# EAGLE design Schematic (EAGLE 7.6.0)
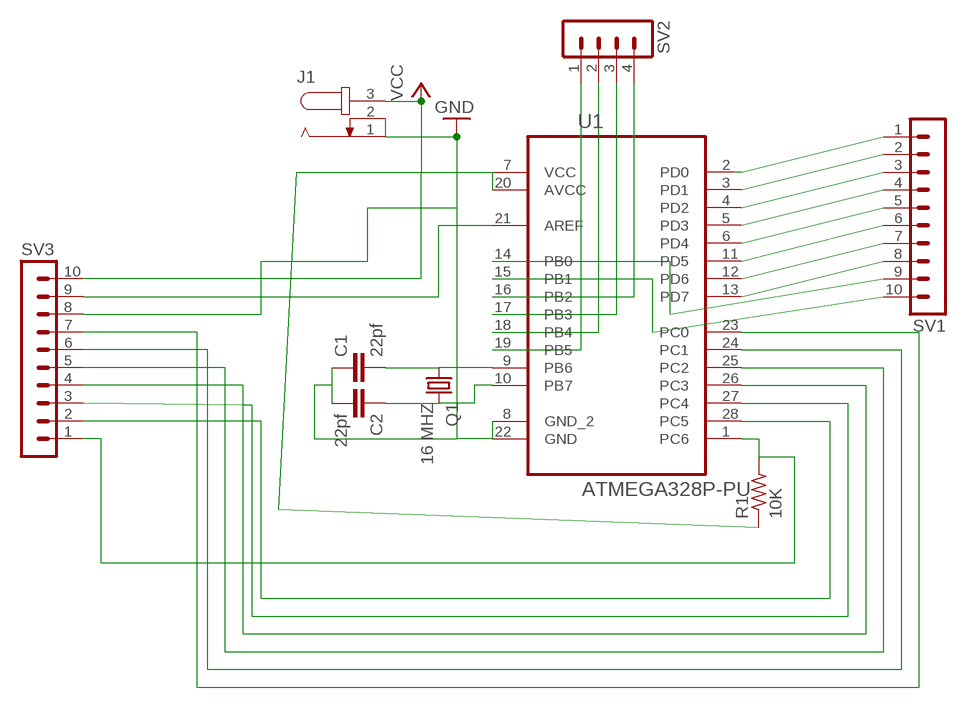
[diagram p0: schematic, sheet 1]

## Parts
C1  22pf  C-EU025-024X044  [C025-024X044]
C2  22pf  C-EU025-024X044  [C025-024X044]
J1  JACK-PLUG0  [SPC4077]
Q1  16 MHZ  CRYSTALHC49S  [HC49/S]
R1  10K  R-US_0207/10  [0207/10]
SV1  MA10-1  [MA10-1]
SV2  MA04-1  [MA04-1]
SV3  MA10-1  [MA10-1]
U1  ATMEGA328P-PU  [DIP254P762X457-28]

## Nets
GND: C1.1 C2.2 J1.1 J1.2 SV3.8 U1.8(GND_2) U1.22(GND)
N$3: C1.2 Q1.1 U1.9(PB6)
N$4: C2.1 Q1.2 U1.10(PB7)
N$5: SV1.1 U1.2(PD0)
N$6: SV1.2 U1.3(PD1)
N$7: R1.2 SV3.1 U1.1(PC6)
N$8: SV1.3 U1.4(PD2)
N$9: SV1.4 U1.5(PD3)
N$10: SV1.5 U1.6(PD4)
N$11: SV1.6 U1.11(PD5)
N$12: SV1.7 U1.12(PD6)
N$13: SV1.8 U1.13(PD7)
N$14: SV1.9 U1.14(PB0)
N$15: SV1.10 U1.15(PB1)
N$16: SV2.4 U1.16(PB2)
N$17: SV2.3 U1.17(PB3)
N$18: SV2.2 U1.18(PB4)
N$21: SV3.2 U1.28(PC5)
N$22: SV3.3 U1.27(PC4)
N$23: SV3.4 U1.26(PC3)
N$24: SV3.5 U1.25(PC2)
N$25: SV3.6 U1.24(PC1)
N$26: SV3.7 U1.23(PC0)
N$27: SV3.9 U1.21(AREF)
N$32: SV2.1 U1.19(PB5)
VCC: J1.3 R1.1 SV3.10 U1.7(VCC) U1.20(AVCC)

## Library data of the parts
C1 C2 = resistor:C-EU: CAPACITOR, European symbol
J1 = con-jack:JACK-PLUG: DC POWER JACK Power Jack, DC, Right Angle, Through Hole, Rated 5A at 16VDC, PC Terminals Distributor: Farnell (www.Farnell.de) Drawing: 84N1161.pdf / 84N1162.pdf Manufacturer: SPC Technology (www.spctechnology.com) Type: SPC4077 / SPC 4078; OC_FARNELL: unknown; OC_NEWARK: unknown
Q1 = crystal:CRYSTAL: CRYSTAL; OC_FARNELL: 1667008; OC_NEWARK: unknown
R1 = resistor:R-US_: RESISTOR, American symbol
SV1 SV3 = con-lstb:MA10-1: PIN HEADER; OC_FARNELL: unknown; OC_NEWARK: unknown
SV2 = con-lstb:MA04-1: PIN HEADER; OC_FARNELL: unknown; OC_NEWARK: unknown
U1 = Atmel_By_element14_Batch_1-00:ATMEGA328P-PU: 8-bit Microcontroller with In-System Programmable Flash; MPN: ATMEGA328P-PU; OC_FARNELL: 1715487; OC_NEWARK: 15R0268; PACKAGE: PDIP-28; SUPPLIER: Atmel

## Board
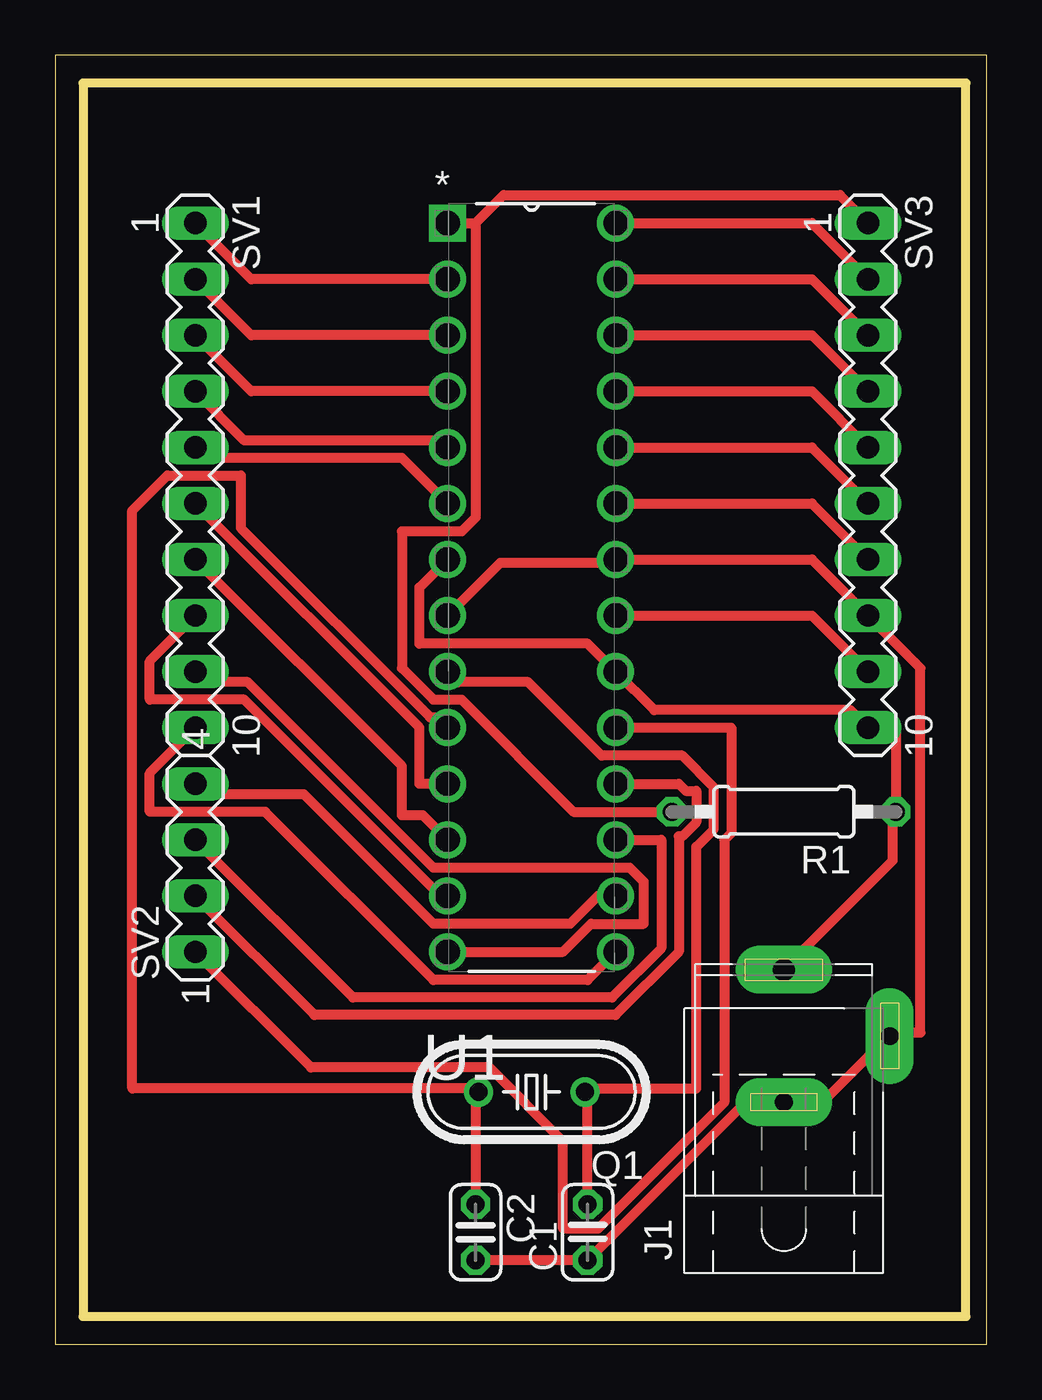
[diagram p1: board, top side]

Size 42.22 x 58.41 mm. Coordinates in mm from the lower left corner, seen from the top.
Outline: 0,0 42.22,0 42.22,58.41 0,58.41 0,0
Outline: 1.27,57.15 1.27,1.27 41.27,1.27 41.27,57.15 1.27,57.15
Copper layers (1*16): Top 0.035mm / dielectric 1.5mm / Bottom 0.035mm
Design rules "default *": minimum track width 18mil, minimum drill 28mil, track to track 8mil, track to pad 8mil, pad to pad 8mil, via to via 8mil, smd to smd 8mil, copper to edge 40mil, drill to drill 8mil, minimum pad ring 10mil, minimum via ring 8mil, stop-mask expansion 4mil, vias tented up to drill 0mil, thermal gap 10mil

### Footprints (pad centres in the part's own frame; a part is rotated, then mirrored left to right if it is on the bottom)
C025-024X044 = drill 0.813 octagon: 1 -1.27,0; 2 1.27,0
SPC4077 = drill 0.8 pad 2.184 long: 1 -3,0; 2 0,-4.8 | drill 1 pad 2.184 long: 3 3,0
HC49/S = drill 0.813: 1 -2.413,0; 2 2.413,0
0207/10 = drill 0.813 octagon: 1 -5.08,0; 2 5.08,0
MA10-1 = drill 1.016 long: 1 -11.43,0; 2 -8.89,0; 3 -6.35,0; 4 -3.81,0; 5 -1.27,0; 6 1.27,0; 7 3.81,0; 8 6.35,0; 9 8.89,0; 10 11.43,0
MA04-1 = drill 1.016 long: 1 -3.81,0; 2 -1.27,0; 3 1.27,0; 4 3.81,0
DIP254P762X457-28 = drill 1.118 square: 1 -7.62,33.02 | drill 1.118: 2 -7.62,30.48; 3 -7.62,27.94; 4 -7.62,25.4; 5 -7.62,22.86; 6 -7.62,20.32; 7 -7.62,17.78; 8 -7.62,15.24; 9 -7.62,12.7; 10 -7.62,10.16; 11 -7.62,7.62; 12 -7.62,5.08; 13 -7.62,2.54; 14 -7.62,0; 15 0,0; 16 0,2.54; 17 0,5.08; 18 0,7.62; 19 0,10.16; 20 0,12.7; 21 0,15.24; 22 0,17.78; 23 0,20.32; 24 0,22.86; 25 0,25.4; 26 0,27.94; 27 0,30.48; 28 0,33.02

### Placement (x,y rotation side)
C1  24.13,5.08 90 top
C2  19.05,5.08 270 top
J1  33.02,13.97 90 top
Q1  21.59,11.43 180 top
R1  33.02,24.13 180 top
SV1  6.35,39.37 270 top
SV2  6.35,21.59 90 top
SV3  36.83,39.37 270 top
U1  25.4,17.78 0 top

### Tracks (layer width: path | path; a pad name or v marks a point on that pad's centre or on a via)
GND
  Top 0.457: U1.8 20.16,35.4 25.24,35.4 U1.22 34.29,35.56 SV3.8 39.21,30.64 39.21,14.13 37.94,14.13 J1.2 37.78,13.97 34.92,11.11 33.18,11.11 J1.1 33.02,10.95 31.27,10.95 C1.1 C2.2
N$3
  Top 0.457: C1.2 24.13,11.43 Q1.1 24.29,11.59 29.05,11.59 29.05,22.54 29.84,23.34 29.84,25.24 28.42,26.67 24.77,26.67 21.43,30 18.26,30 U1.9
N$4
  Top 0.457: C2.1 19.05,11.43 Q1.2 18.89,11.59 3.49,11.59 3.49,37.78 5.08,39.37 8.41,39.37 8.41,36.99 16.99,28.42 17.3,28.42 U1.10
N$5
  Top 0.457: SV1.1 8.89,48.26 U1.2
N$6
  Top 0.457: SV1.2 8.89,45.72 U1.3
N$7
  Top 0.457: R1.2 23.5,24.13 18.41,29.21 17.14,29.21 15.72,30.64 15.72,36.83 18.41,36.83 19.05,37.47 19.05,50.8 | U1.1 19.05,50.8 | SV3.1 35.56,52.07 20.32,52.07 19.05,50.8
N$8
  Top 0.457: SV1.3 8.89,43.18 U1.4
N$9
  Top 0.457: SV1.4 8.57,40.96 17.46,40.96 U1.5
N$10
  Top 0.457: SV1.5 6.83,40.16 15.72,40.16 U1.6
N$11
  Top 0.457: SV1.6 16.51,27.94 16.51,25.4 U1.11
N$12
  Top 0.457: SV1.7 15.72,26.19 15.72,23.97 16.67,23.97 U1.12
N$13
  Top 0.457: SV1.8 4.29,30.96 4.29,29.21 8.57,29.21 17.46,20.32 U1.13
N$14
  Top 0.457: SV1.9 6.83,30 8.73,30 17.14,21.59 26.04,21.59 26.67,20.95 26.67,19.05 24.29,19.05 23.02,17.78 U1.14
N$15
  Top 0.457: SV1.10 4.29,25.88 4.29,24.13 9.53,24.13 17.14,16.51 24.13,16.51 U1.15
N$16
  Top 0.457: SV2.4 6.83,24.92 11.27,24.92 17.14,19.05 23.34,19.05 24.61,20.32 U1.16
N$17
  Top 0.457: SV2.3 13.49,15.72 25.24,15.72 27.46,17.94 27.46,22.86 U1.17
N$18
  Top 0.457: SV2.2 11.75,14.92 25.4,14.92 28.26,17.78 28.26,23.02 28.42,23.02 29.05,23.65 29.05,25.08 28.57,25.08 28.26,25.4 U1.18
N$21
  Top 0.457: SV3.2 34.29,50.8 U1.28
N$22
  Top 0.457: SV3.3 34.29,48.26 U1.27
N$23
  Top 0.457: SV3.4 34.29,45.72 U1.26
N$24
  Top 0.457: SV3.5 34.29,43.18 U1.25
N$25
  Top 0.457: SV3.6 34.29,40.64 U1.24
N$26
  Top 0.457: SV3.7 34.29,38.1 U1.23
N$27
  Top 0.457: SV3.9 34.29,33.02 U1.21
N$32
  Top 0.457: SV2.1 11.59,12.54 19.68,12.54 23.02,9.21 23.02,5.24 24.61,5.24 30.32,10.95 30.32,22.86 30.64,23.18 30.64,27.94 U1.19
VCC
  Top 0.457: U1.7 16.51,34.29 16.51,31.75 24.13,31.75 U1.20 27.15,28.73 36.04,28.73 SV3.10 38.1,27.94 R1.1 37.94,23.97 37.94,21.91 33.02,16.99 J1.3

### Text on the board
bNames: D0 | RST | D1 | A5 | D2 | A4 | D3 | A3 | D4 | A2 | D5 | A1 | D6 | A0 | D7 | GND | D8 | AREF | D9 | VCC | D10 | D11 | D12 | D13 | © 2017 | BasselTech